# EAGLE design v002 (EAGLE 6.5.0)
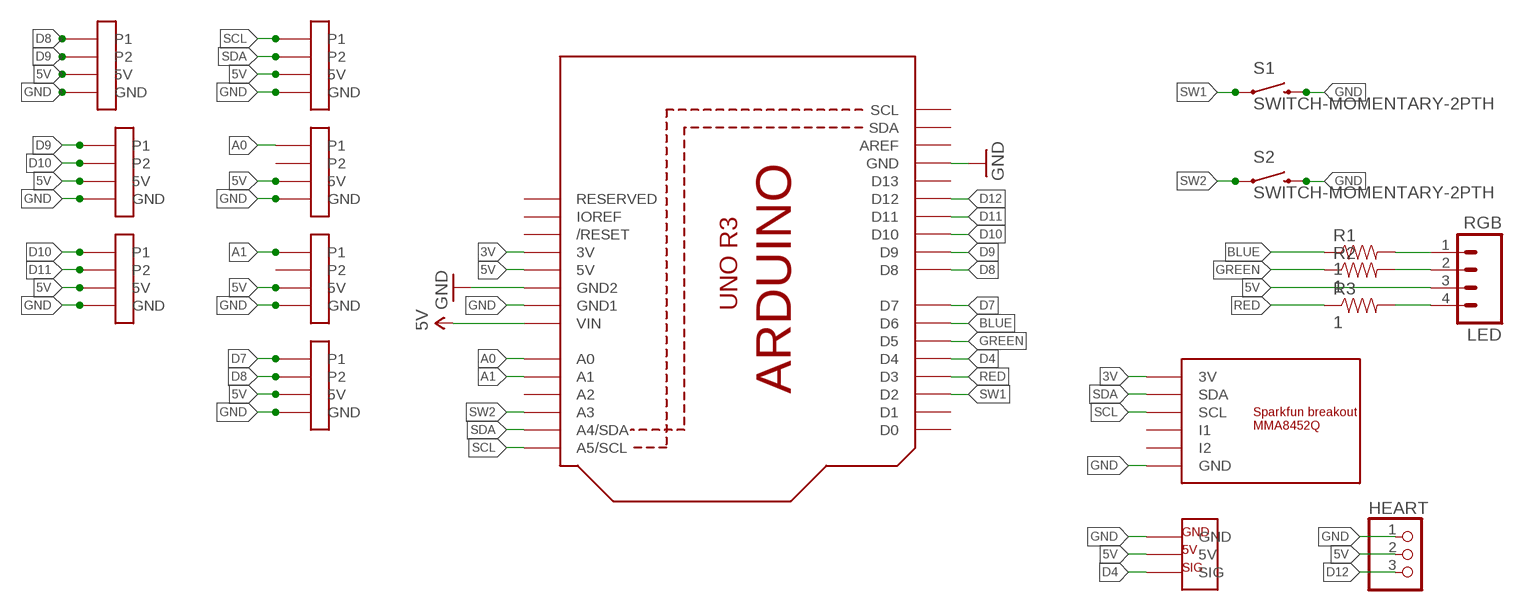
[diagram p0: schematic, sheet 1]

## Parts
HEART  PINHD-1X3CB  [1X03-CLEANBIG]
LED  RGB  M04PTH  [1X04]
R1  1  RESISTORPTH-1/4W  [AXIAL-0.4]
R2  1  RESISTORPTH-1/4W  [AXIAL-0.4]
R3  1  RESISTORPTH-1/4W  [AXIAL-0.4]
S1  SWITCH-MOMENTARY-2PTH  [TACTILE-PTH]
S2  SWITCH-MOMENTARY-2PTH  [TACTILE-PTH]
U1  ARDUINOR3-BPLACE  [ARDUINOR3-BPLACE]
U$1  MMA8452Q  [SPARKFUN-MMA8452Q]
U$2  PING)))  [PING)))]
U$4  4PINJST  [4PINJST]
U$5  4PINJST  [4PINJST]
U$6  4PINJST  [4PINJST]
U$7  4PINJST  [4PINJST]
U$8  4PINJST  [4PINJST]
U$9  4PINJST  [4PINJST]
U$10  4PINJST  [4PINJST]

## Nets
3V: U1.3V U$1.3V
5V: HEART.2 LED.3 U1.5V U1.VIN U$2.5V U$4.5V U$5.5V U$6.5V U$7.5V U$8.5V U$9.5V U$10.5V
A0: U1.A0 U$5.P1
A1: U1.A1 U$6.P1
BLUE: R1.P$1 U1.D6
D4: U1.D4 U$2.SIG
D7: U1.D7 U$7.P1
D8: U1.D8 U$7.P2 U$8.P1
D9: U1.D9 U$8.P2 U$9.P1
D10: U1.D10 U$9.P2 U$10.P1
D11: U1.D11 U$10.P2
D12: HEART.3 U1.D12
GND: HEART.1 S1.3 S2.3 U1.GND U1.GND1 U1.GND2 U$1.GND U$2.GND U$4.GND U$5.GND U$6.GND U$7.GND U$8.GND U$9.GND U$10.GND
GREEN: R2.P$1 U1.D5
N$1: LED.1 R1.P$2
N$2: LED.2 R2.P$2
N$3: LED.4 R3.P$2
RED: R3.P$1 U1.D3
SCL: U1.A5(A5/SCL) U$1.SCL U$4.P1
SDA: U1.A4(A4/SDA) U$1.SDA U$4.P2
SW1: S1.1 U1.D2
SW2: S2.1 U1.A3
Unconnected: U1.A2 U1.AREF U1.D0 U1.D1 U1.D13 U1.IOREF U1.RESERVED U1.RESET(/RESET) U1.SCL U1.SDA U$1.I1 U$1.I2 U$5.P2 U$6.P2

## Library data of the parts
HEART = adafruit:PINHD-1X3: PIN HEADER
LED = SparkFun-Connectors:M04: Header 4 Standard 4-pin 0.1" header. Use with straight break away headers (SKU : PRT-00116), right angle break away headers (PRT-00553), swiss pins (PRT-00743), machine pins (PRT-00117), and female headers (PRT-00115). Molex polarized connector foot print use with SKU : PRT-08231 with associated crimp pins and housings. 1MM SMD Version SKU: PRT-10208
R1-R3 = SparkFun-Passives:RESISTOR: Resistor Basic schematic elements and footprints for 0603, 1206, and PTH resistors.
S1 S2 = SparkFun-Electromechanical:SWITCH-MOMENTARY-2: Various NO switches- pushbuttons, reed, etc
U1 = adafruit:ARDUINOR3: This is a new object for the new Arduino R3 - with extra pins that you may want to use (such as IOref, and duplicated A4/A5
U$1 = hk.morgan.eagle:MMA8452Q
U$2 = hk.morgan.eagle:PING)))
U$4-U$10 = hk.morgan.eagle:4PINJST

## Board
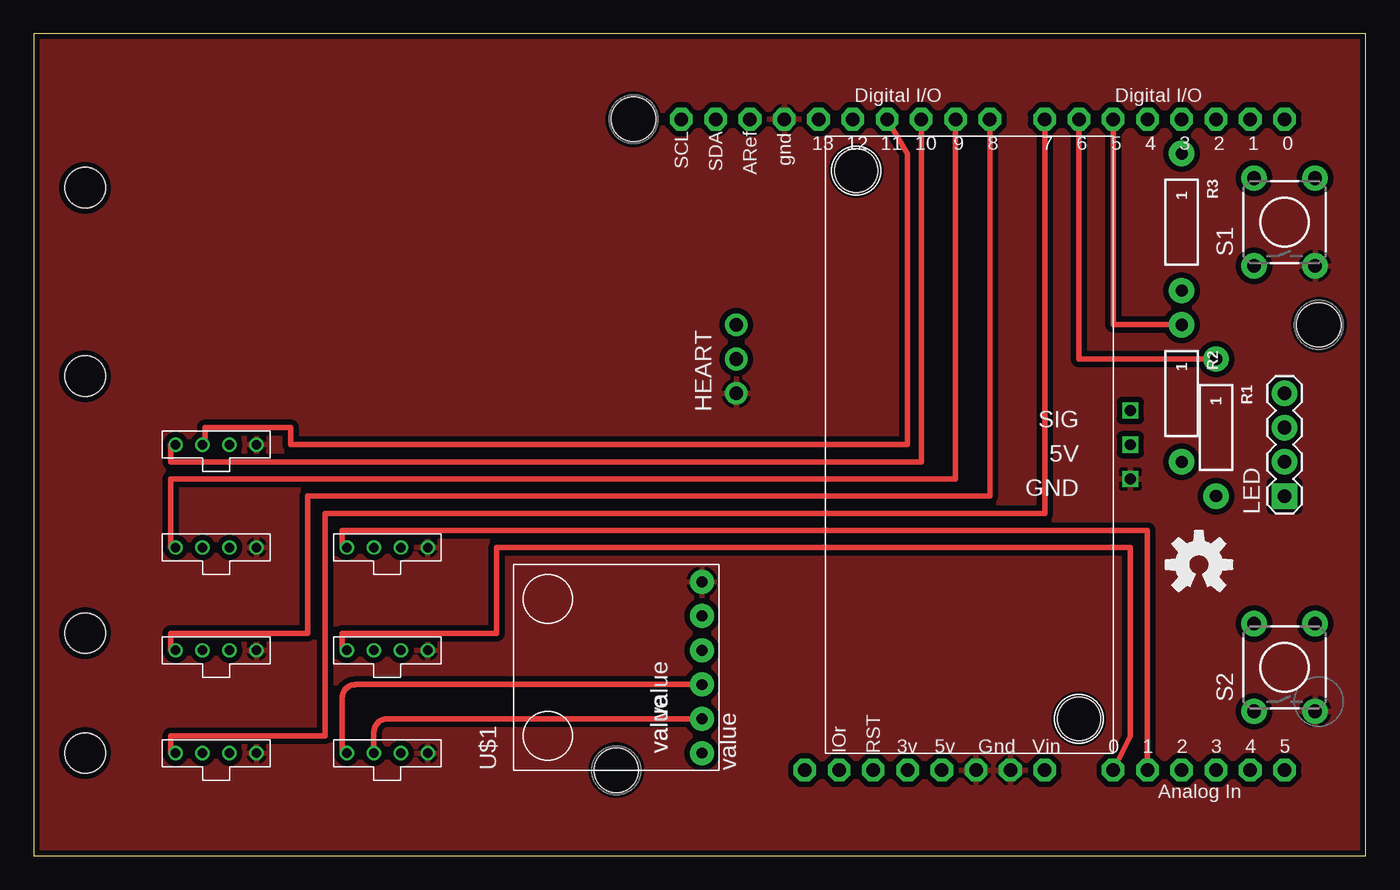
[diagram p1: board, top side]
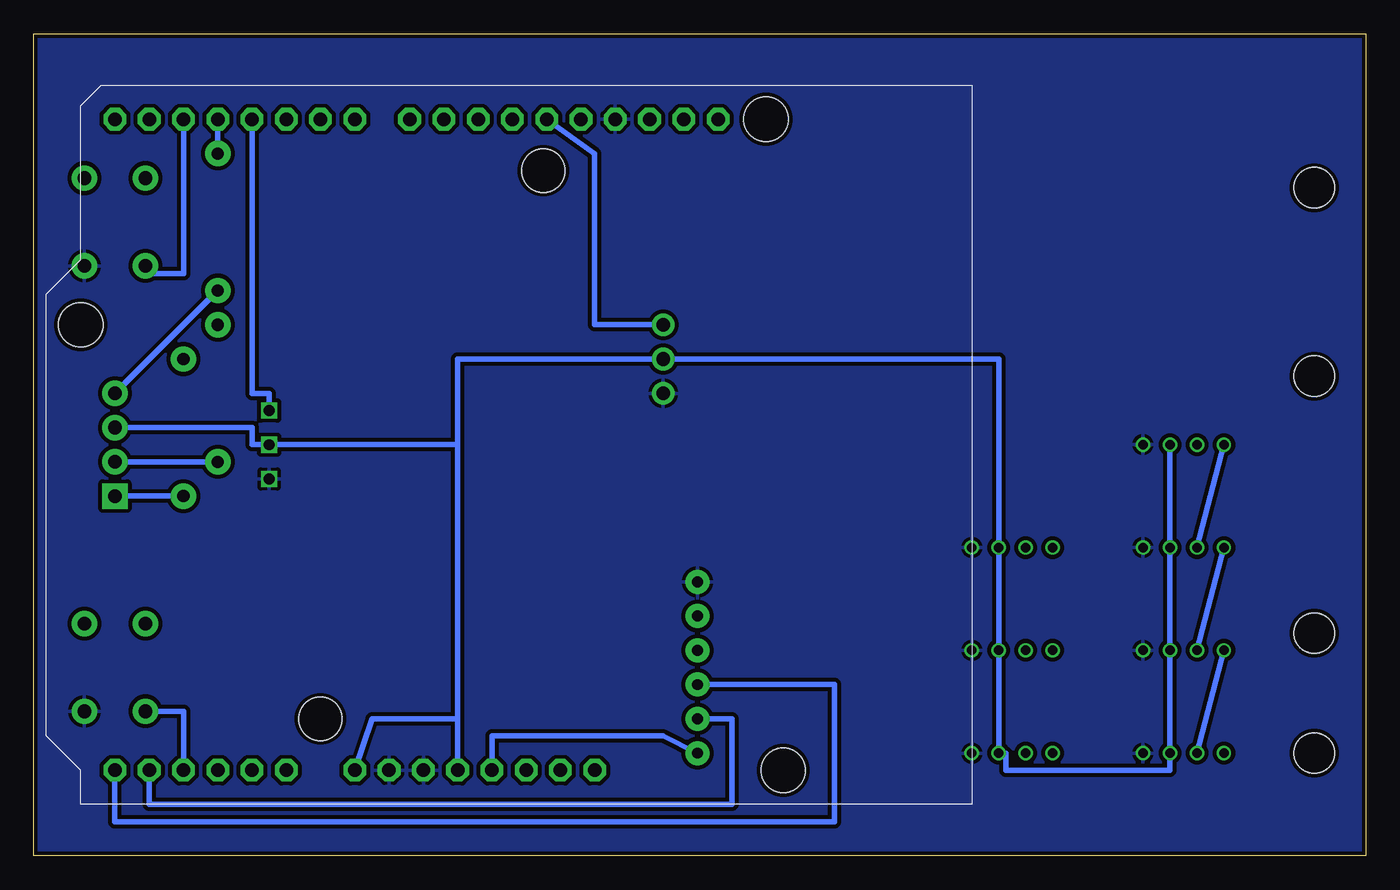
[diagram p2: board, bottom side, seen from below]

Size 98.73 x 60.95 mm. Coordinates in mm from the lower left corner, seen from the top.
Outline: 0,0 98.73,0 98.73,60.95 0,60.95 0,0
Copper layers (1*2*15*16): Top 0.035mm / dielectric 0.2mm / layer 2 0.0175mm / dielectric 1.1mm / layer 15 0.0175mm / dielectric 0.2mm / Bottom 0.035mm
Design rules "SeeedStudio_DRU_no_angle_20130527": minimum track width 6mil, minimum drill 12mil, track to track 6mil, track to pad 6mil, pad to pad 6mil, via to via 6mil, smd to smd 0mil, copper to edge 10mil, drill to drill 10mil, minimum pad ring 6mil, minimum via ring 6mil, stop-mask expansion 2mil, vias tented up to drill 25mil, thermal gap 10mil
Holes 3 mm at 3.81,7.62 3.81,16.51 3.81,49.53 3.81,35.56
Holes 3.3 mm at 44.45,54.61 95.25,39.37 43.18,6.35
Holes 3.2 mm at 60.96,50.8 77.47,10.16

### Footprints (pad centres in the part's own frame; a part is rotated, then mirrored left to right if it is on the bottom)
1X03-CLEANBIG = drill 1.016 pad 1.676: 1 -2.54,0; 2 0,0; 3 2.54,0
1X04 = drill 1.016 pad 1.88 square: 1 0,0 | drill 1.016 pad 1.88: 2 2.54,0; 3 5.08,0; 4 7.62,0
AXIAL-0.4 = drill 0.9 pad 1.88: P$1 -5.08,0; P$2 5.08,0
TACTILE-PTH = drill 1.016 pad 1.88: 1 -3.251,2.261; 2 3.251,2.261; 3 -3.251,-2.261; 4 3.251,-2.261
ARDUINOR3-BPLACE = drill 1 pad 1.676 octagon: 3V 35.56,2.54; 5V 38.1,2.54; A0 50.8,2.54; A1 53.34,2.54; A2 55.88,2.54; A3 58.42,2.54; A4 60.96,2.54; A5 63.5,2.54; AREF 23.876,50.8; D0 63.5,50.8; D1 60.96,50.8; D2 58.42,50.8; D3 55.88,50.8; D4 53.34,50.8; D5 50.8,50.8; D6 48.26,50.8; D7 45.72,50.8; D8 41.656,50.8; D9 39.116,50.8; D10 36.576,50.8; D11 34.036,50.8; D12 31.496,50.8; D13 28.956,50.8; GND 26.416,50.8; GND1 43.18,2.54; GND2 40.64,2.54; IOREF 30.48,2.54; RESERVED 27.94,2.54; RESET 33.02,2.54; SCL 18.796,50.8; SDA 21.336,50.8; VIN 45.72,2.54
SPARKFUN-MMA8452Q = drill 0.8 pad 1.778: 3V 1.27,1.27; GND 13.97,1.27; I1 8.89,1.27; I2 11.43,1.27; SCL 6.35,1.27; SDA 3.81,1.27
PING))) = drill 0.8 square: 5V 22.86,-1.27; GND 20.32,-1.27; SIG 25.4,-1.27
4PINJST = drill 0.7: 5V 2,0; GND 0,0; P1 6,0; P2 4,0

### Placement (x,y rotation side)
HEART  52.07,36.83 90 top
LED  92.71,26.67 90 top
R1  87.63,31.75 270 top
R2  85.09,34.29 270 top
R3  85.09,46.99 270 top
S1  92.71,46.99 90 top
S2  92.71,13.97 90 top
U1  29.21,3.81 0 top
U$1  50.8,6.35 90 top
U$2  80.01,7.62 90 top
U$3  [OSHW-LOGO-M]  86.36,21.59 0 top
U$4  29.21,7.62 180 top
U$5  29.21,15.24 180 top
U$6  29.21,22.86 180 top
U$7  16.51,7.62 180 top
U$8  16.51,15.24 180 top
U$9  16.51,22.86 180 top
U$10  16.51,30.48 180 top

### Tracks (layer width: path | path; a pad name or v marks a point on that pad's centre or on a via)
3V
  Bottom 0.406: U1.3V 64.77,8.89 52.07,8.89 U$1.3V
5V
  Bottom 0.406: LED.3 82.55,31.75 82.55,30.48 U$2.5V 67.31,30.48 | 67.31,30.48 67.31,36.83 HEART.2 27.21,36.83 U$6.5V U$5.5V U$4.5V 26.67,7.62 26.67,6.35 14.51,6.35 U$7.5V U$8.5V U$9.5V U$10.5V | 67.31,30.48 67.31,10.16 | U1.5V 67.31,10.16 | 67.31,10.16 73.66,10.16 U1.VIN
A0
  Top 0.406: U$5.P1 22.86,15.24 22.86,16.51 34.29,16.51 34.29,22.86 81.28,22.86 81.28,8.89 U1.A0
A1
  Top 0.406: U$6.P1 22.86,22.86 22.86,24.13 82.55,24.13 U1.A1
BLUE
  Top 0.406: R1.P$1 77.47,36.83 U1.D6
D4
  Bottom 0.406: U$2.SIG 81.28,34.29 82.55,34.29 U1.D4
D7
  Top 0.406: U$7.P1 10.16,7.62 10.16,8.89 21.59,8.89 21.59,25.4 74.93,25.4 U1.D7
D8
  Top 0.406: U$8.P1 10.16,15.24 10.16,16.51 20.32,16.51 20.32,26.67 70.87,26.67 U1.D8
  Bottom 0.406: U$8.P1 U$7.P2
D9
  Top 0.406: U$9.P1 10.16,22.86 10.16,27.94 68.33,27.94 U1.D9
  Bottom 0.406: U$9.P1 U$8.P2
D10
  Top 0.406: U$10.P1 10.16,30.48 10.16,29.21 65.79,29.21 U1.D10
  Bottom 0.406: U$10.P1 U$9.P2
D11
  Top 0.406: U$10.P2 12.7,30.48 12.7,31.75 19.05,31.75 19.05,30.48 64.77,30.48 64.77,52.07 U1.D11
D12
  Bottom 0.406: HEART.3 57.15,39.37 57.15,52.07 U1.D12
GND
  pour Bottom (isolate 0.305): 0,0 0,60.96 99.06,60.96 99.06,0
  pour Top (isolate 0.406): 0,0 0,60.96 99.06,60.96 99.06,0
GREEN
  Top 0.406: R2.P$1 80.01,39.37 U1.D5
N$1
  Bottom 0.406: R1.P$2 LED.1
N$2
  Bottom 0.406: R2.P$2 LED.2
N$3
  Bottom 0.406: LED.4 R3.P$2
RED
  Bottom 0.406: R3.P$1 U1.D3
SCL
  Top 0.406: U$4.P1 22.86,7.62 22.86,11.7 arc-90 23.86,12.7 U$1.SCL
  Bottom 0.406: U1.A5 92.71,2.54 39.37,2.54 39.37,12.7 U$1.SCL
SDA
  Top 0.406: U$4.P2 25.21,9.16 arc-90 26.21,10.16 U$1.SDA
  Bottom 0.406: U1.A4 90.17,3.81 46.99,3.81 46.99,10.16 U$1.SDA
SW1
  Bottom 0.406: U1.D2 87.63,43.18 90.45,43.18 S1.1
SW2
  Bottom 0.406: S2.1 87.63,10.72 U1.A3

### Text on the board
toptext: D10/D11 | A1 | D9/D10 | A0 | D8/D9 | I2C | D7/D8 | v0.02 | 2013-11-14 | CLOrk performance shield